# Altium schematic sheet Encoder-Sheet.SchDoc
size A4; DocumentNumber: 4; SheetNumber: 4; SheetTotal: 8
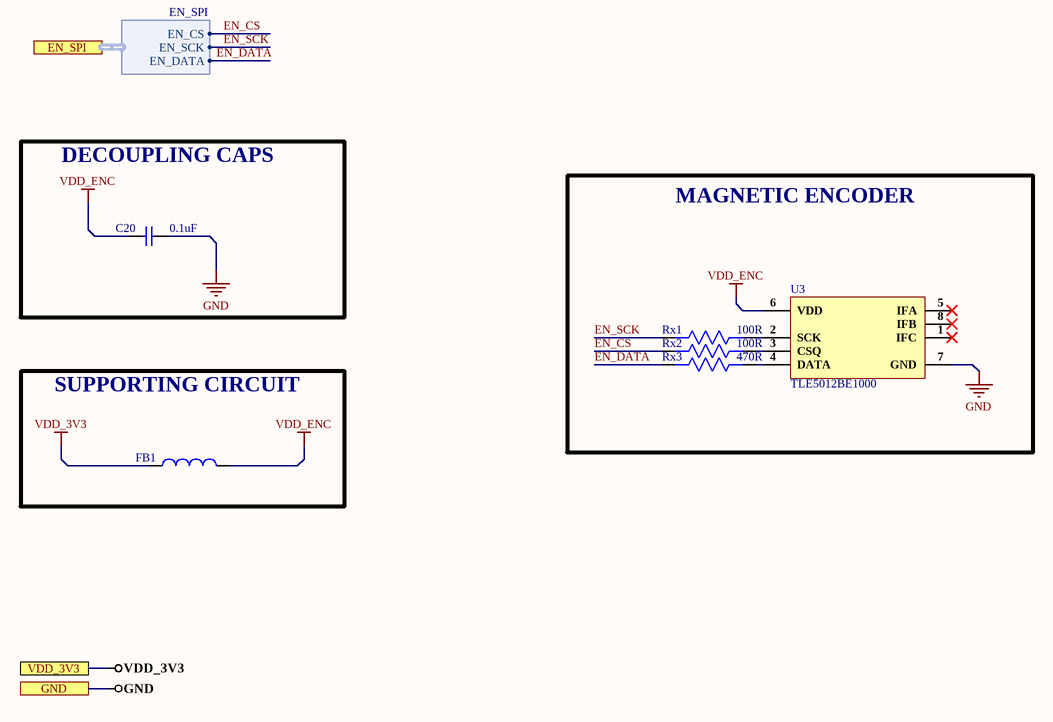
[diagram p0: Encoder-Sheet.SchDoc]

## Parts
C20  0.1uF  [Cap 0603]
FB1  MPZ1608S121ATDH5  [MPZ1608S121ATDH5]  (value not drawn)
Rx1  100R  [Res0603]
Rx2  100R  [Res0603]
Rx3  470R  [Res0603]
U3  TLE5012BE1000  [PG-DSO-8]

## Blocks framed on the sheet
DECOUPLING CAPS: C20
MAGNETIC ENCODER: Rx1-Rx3 U3
SUPPORTING CIRCUIT: FB1

## Ports
EN_SPI (harness EN_SPI), GND, VDD_3V3

## Harnesses
EN_SPI: EN_CS, EN_SCK, EN_DATA

## Nets
GND: C20.2 U3.7(GND) ; port GND
VDD_3V3: FB1.1 ; port VDD_3V3
VDD_ENC: C20.1 FB1.2 U3.6(VDD)
EN_CS: Rx2.2 ; port EN_SPI.EN_CS
EN_DATA: Rx3.2 ; port EN_SPI.EN_DATA
EN_SCK: Rx1.2 ; port EN_SPI.EN_SCK
NetRx1_1: Rx1.1 U3.2(SCK)
NetRx2_1: Rx2.1 U3.3(CSQ)
NetRx3_1: Rx3.1 U3.4(DATA)

Not connected (* = marked no-connect by the designer): U3 1(IFC)* 5(IFA)* 8(IFB)*

## Library data of the parts
C20 = CL10B104KB8NNNC: Cap Ceramic 0.1uF 50VDC X7R 10% SMD 0603 Paper T/R; Manufacturer: Samsung; Capacitance: 100nF; Voltage Rating: 50V; Supplier 1: Digi-Key; Manufacturer Part Number: CL10B104KB8NNNC; RoHS: Yes; Category: Ceramic Capacitors; Stock 1: 3998791; Pricing 1: 1=0.10000, 10=0.03000, 50=0.01640, 100=0.01340, 500=0.00954, 1000=0.00750 (USD); Mount: Surface Mount; Case/Package: 0603; Case Code (Metric): 1608; Case Code (Imperial): 0603; Material: Ceramic; Contact Plating: Tin; Min Operating Temperature: -55°C; Max Operating Temperature: 125°C; Dielectric: X7R; Tolerance: 10%; Package Quantity: 1; Packaging: Tape and Reel; Voltage: 50V; Voltage Rating (DC): 50V; Series: CL; Construction: Flat; Length: 1.6mm; Width: 0.031inch; Height: 0.8mm; Depth: 0.8mm; Thickness: 0.035inch; Radiation Hardening: No; Lead Free: Lead Free; RoHS Compliant: Yes; ComponentLink1URL: https://datasheet.ciiva.com/25803/cl10b104kb8nnnc-25803393.pdf?src-supplier=Digi-Key; ComponentLink1Description: https://datasheet.ciiva.com/25803/cl10b104kb8nnnc-25803393.pdf?src-supplier=Digi-Key; ComponentLink2URL: https://datasheet.ciiva.com/26838/getdatasheetpartid-89097-26838411.pdf?src-supplier=Verical; ComponentLink2Description: https://datasheet.ciiva.com/26838/getdatasheetpartid-89097-26838411.pdf?src-supplier=Verical; ComponentLink3URL: https://datasheet.ciiva.com/29198/456651-da-01-en-vs-kondensator-0605-29198839.pdf?src-supplier=Conrad; ComponentLink3Description: https://datasheet.ciiva.com/29198/456651-da-01-en-vs-kondensator-0605-29198839.pdf?src-supplier=Conrad; Supplier Part Number 1: 1276-1000-1-ND
FB1 = MPZ1608S121ATDH5: Ferrite Beads Multi-Layer 120Ohm 25% 100MHz 2A 45mOhm DCR 0603 Automotive T/R; Manufacturer: TDK; Number of Lines: 1; DC Resistance (DCR): 45mR; Impedance: 120R; Supplier 1: Digi-Key; Manufacturer Part Number: MPZ1608S121ATDH5; RoHS: Yes; Category: Ferrite Beads and Chips; Pricing 1: 1=0.11000, 10=0.08600, 25=0.07720, 50=0.05660, 100=0.04890, 250=0.03860, 500=0.03260, 1000=0.02746 (USD); Mount: Surface Mount; Case/Package: 0603; Case Code (Metric): 1608; Case Code (Imperial): 0603; Weight: 7.1E-05oz; Min Operating Temperature: -55°C; Max Operating Temperature: 125°C; Package Quantity: 4000; Packaging: Tape and Reel; Max Current Rating: 2A; Termination: SMD/SMT; Max DC Current: 2A; Tolerance: 25%; Test Frequency: 100MHz; Length: 0.063inch; Width: 0.031inch; Height: 0.03inch; Ratings: AEC-Q200; RoHS Compliant: Yes; ComponentLink1URL: https://media.digikey.com/pdf/Data%20Sheets/TDK%20PDFs/MPZ_Series_Br.pdf?src-supplier=Digi-Key; ComponentLink1Description: https://media.digikey.com/pdf/Data%20Sheets/TDK%20PDFs/MPZ_Series_Br.pdf?src-supplier=Digi-Key; ComponentLink2URL: http://www.mouser.com/ds/2/400/eads_commercial_power_mpz1608_en-923650.pdf?src-supplier=Mouser; ComponentLink2Description: http://www.mouser.com/ds/2/400/eads_commercial_power_mpz1608_en-923650.pdf?src-supplier=Mouser; ComponentLink3URL: https://product.tdk.com/info/en/catalog/datasheets/beads_automotive_power_mpz1608_en.pdf?src-supplier=Digi-Key; ComponentLink3Description: https://product.tdk.com/info/en/catalog/datasheets/beads_automotive_power_mpz1608_en.pdf?src-supplier=Digi-Key; Supplier Part Number 1: 445-172891-6-ND
Rx1 Rx2 = RC0603FR-07100RL: RES SMD 100 OHM 1% 1/10W 0603; Manufacturer: Yageo; Temperature Coefficient: 100ppm/°C; Voltage Rating (DC): 50V; Power Rating: 100mW; Supplier 1: Arrow Electronics; Manufacturer Part Number: RC0603FR-07100RL; RoHS: Yes; Category: Chip SMD Resistors; Stock 1: 3800000; Pricing 1: 5000=0.00300, 5000=0.00200, 5000=0.00450, 50000=0.00410, 500000=0.00230, 2500000=0.00140 (USD); Case/Package: 0603; Number of Pins: 2; Case Code (Imperial): 0603; Case Code (Metric): 1608; Size Code: 0603; Min Operating Temperature: -55°C; Max Operating Temperature: 155°C; Resistance: 100R; Tolerance: 1%; Resistor Type: Thick Film; Packaging: Tape and Reel; Voltage Rating: 50V; Termination: SMD/SMT; Features: Moisture Resistant; Series: RC; Max Power Dissipation: 100mW; Number of Terminations: 2; Construction: Rectangular; Resistance Tolerance: 1%; Technology: THICK FILM; Length: 1.6mm; Width: 0.8mm; Height: 0.45mm; Depth: 0.8mm; REACH SVHC: Unknown; Lead Free: Lead Free; RoHS Compliant: Yes; Military Standard: Not; Supplier Part Number 1: RC0603FR-07100RL
Rx3 = RC0603FR-07470RL: RES SMD 470 OHM 50 V, 0603 100 mW,  1%, RC Series; Manufacturer: Yageo; Power Rating: 100mW; Voltage Rating: 50V; Temperature Coefficient: 100ppm/°C; Working Voltage: 75V; Supplier 1: Digi-Key; Manufacturer Part Number: RC0603FR-07470RL; RoHS: Yes; Category: Chip SMD Resistors; Stock 1: 154083; Pricing 1: 1=0.10000, 10=0.02400, 100=0.00970, 1000=0.00436, 2500=0.00378 (USD); Case/Package: 0603; Case Code (Metric): 1608; Case Code (Imperial): 0603; Min Operating Temperature: -55°C; Max Operating Temperature: 155°C; Tolerance: 1%; Resistance: 470R; Packaging: Tape and Reel; Package Quantity: 1; Resistor Type: Thick Film; Number of Terminations: 2; Termination: SMD/SMT; Max Power Dissipation: 100mW; Features: Moisture Resistant; Series: RC; Technology: THICK FILM; Resistance Tolerance: 1%; Construction: Rectangular; Length: 1.6mm; Width: 0.031inch; Height: 0.022inch; Depth: 0.8mm; RoHS Compliant: Yes; REACH SVHC: No SVHC; Military Standard: Not; Lead Free: Lead Free; ComponentLink1URL: https://datasheet.ciiva.com/11808/0900766b80f96399-11808177.pdf?src-supplier=RSComponents; ComponentLink1Description: https://datasheet.ciiva.com/11808/0900766b80f96399-11808177.pdf?src-supplier=RSComponents; ComponentLink2URL: https://datasheet.ciiva.com/7746/1738695-7746359.pdf?src-supplier=Element14; ComponentLink2Description: https://datasheet.ciiva.com/7746/1738695-7746359.pdf?src-supplier=Element14; ComponentLink3URL: https://datasheet.ciiva.com/7746/1738695-7746360.pdf?src-supplier=Element14; ComponentLink3Description: https://datasheet.ciiva.com/7746/1738695-7746360.pdf?src-supplier=Element14; ComponentLink4URL: https://datasheet.ciiva.com/7660/1868787-7660793.pdf?src-supplier=Element14; ComponentLink4Description: https://datasheet.ciiva.com/7660/1868787-7660793.pdf?src-supplier=Element14; ComponentLink5URL: https://datasheet.ciiva.com/46440/1868787-46440907.pdf?src-supplier=Element14; ComponentLink5Description: https://datasheet.ciiva.com/46440/1868787-46440907.pdf?src-supplier=Element14; ComponentLink6URL: https://datasheet.ciiva.com/2454/pyu-r-int-thick-7-2454012.pdf?src-supplier=Digi-Key; ComponentLink6Description: https://datasheet.ciiva.com/2454/pyu-r-int-thick-7-2454012.pdf?src-supplier=Digi-Key; ComponentLink7URL: https://datasheet.ciiva.com/2454/pyu-r-int-thick-7-2454013.pdf?src-supplier=Digi-Key; ComponentLink7Description: https://datasheet.ciiva.com/2454/pyu-r-int-thick-7-2454013.pdf?src-supplier=Digi-Key; ComponentLink8URL: https://datasheet.ciiva.com/2454/pyu-r-int-thick-7-2454014.pdf?src-supplier=Digi-Key; ComponentLink8Description: https://datasheet.ciiva.com/2454/pyu-r-int-thick-7-2454014.pdf?src-supplier=Digi-Key; Supplier Part Number 1: 311-470HRCT-ND
U3 = TLE5012BE1000: SENSOR ANGLE 360DEG SMD; Manufacturer: Infineon; Interface: SPI; Supplier 1: RSComponents; Manufacturer Part Number: TLE5012BE1000; RoHS: Yes; Category: Magnetic Sensors; Stock 1: 1; Pricing 1: 10=6.13600, 100=5.33500, 250=5.04900, 500=4.90100, 1000=4.77700 (USD); Case/Package: SOIC; Number of Pins: 8; Package Quantity: 2500; Packaging: Tape and Reel; RoHS Compliant: Yes; REACH SVHC: No SVHC; Supplier Part Number 1: 1702338